# Altium schematic sheet TNY276PN_5V_800mA_SMPS.SchDoc
size A4; SheetNumber: 1; SheetTotal: 1
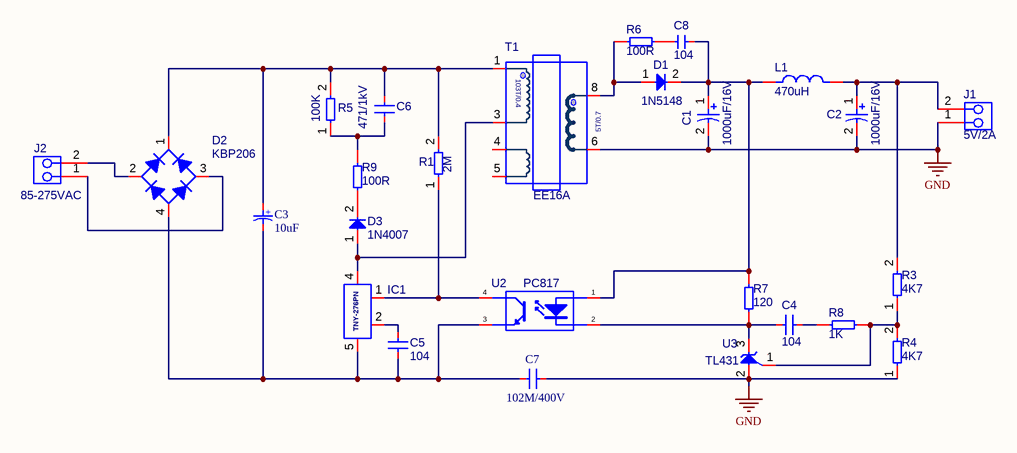
[diagram p0: TNY276PN_5V_800mA_SMPS.SchDoc]

## Parts
C1  1000uF/16V  [CAP_RAD_3.5mm]
C2  1000uF/16V  [CAP_RAD_3.5mm]
C3  10uF  [CAP_RAD_D10x12.5_POL_BK]
C4  104  [CAP_DISC_4x3_YL]
C5  104  [CAP_DISC_104]
C6  471/1kV  [CAP_DISC_4x3_YL]
C7  102M/400V  [CAP_DISC_Y2222]
C8  104  [CAP_Ceramic_Disc_2]
D1  1N5148  [DO-41]
D2  KBP206  [DIODE-KBP206]
D3  1N4007  [DO-41]
IC1  TNY-276PN  [TNY-276PN-DIP-8C]  (value not drawn)
J1  5V/2A  [DG306-5.0-02P-12-00AH]
J2  85-275VAC  [DG127-5.0-02P-14-00AH]
L1  470uH  [RLB0812_vertical]
R1  2M  [RES-0.25W-H-MF]
R3  4K7  [RES-0.25W-H-MF]
R4  4K7  [RES-0.25W-H-MF]
R5  100K  [RES-0.25W-H-MF]
R6  100R  [RES-0.25W-H-MF]
R7  120  [RES-0.25W-H-MF]
R8  1K  [RES-0.25W-H-MF]
R9  100R  [RES-0.25W-H-MF]
T1  EE16A  [TRANSFORMER-EE16A]
U2  PC817  [DIP4]
U3  TL431  [TO-92]

## Nets
GND: C1.2 C2.2 C7.2 J1.1 R4.1 T1.6 U3.2
NetC1_1: C1.1 C8.2 D1.2 L1.1 R7.2 U2.1(A)
NetC2_1: C2.1 J1.2 L1.2 R3.2
NetC3_1: C3.1 C6.2 D2.1(+) R1.2 R5.2 T1.1
NetC3_2: C3.2 C5.1 C7.1 D2.4(-) IC1.5 U2.3(E)
NetC4_1: C4.1 R8.2
NetC4_2: C4.2 R7.1 U2.2(K) U3.3
NetC5_2: C5.2 IC1.2
NetC6_1: C6.1 R5.1 R9.2
NetC8_1: C8.1 R6.2
NetD1_1: D1.1 R6.1 T1.8
NetD2_2: D2.2(AC) J2.2
NetD2_3: D2.3(AC) J2.1
NetD3_1: D3.1 IC1.4 T1.3
NetD3_2: D3.2 R9.1
NetIC1_1: IC1.1 R1.1 U2.4(C)
NetR3_1: R3.1 R4.2 R8.1 U3.1

Not connected (* = marked no-connect by the designer): T1 4 5

## Notes on the sheet
- (near T1) 103T/0.4
- (near T1) 5T/0.7
- (in symbol Capacitor(Radian)) +

## Library data of the parts
C1-C3 = Capacitor(Radian)
C4-C8 = Capacitors(Disc)
D1 D3 = Diode-1N4007
D2 = Diode-KBP206
IC1 = SMPS-TNY276PN: TinySwitch-III Family
J1 = DG306-5.0-02P-12-00AH
J2 = DG127-5.0-02P-14-00AH
L1 = Inductors
R1 R3-R9 = Resistors THD
T1 = TRANS-EE16A-ATX-VERTICAL